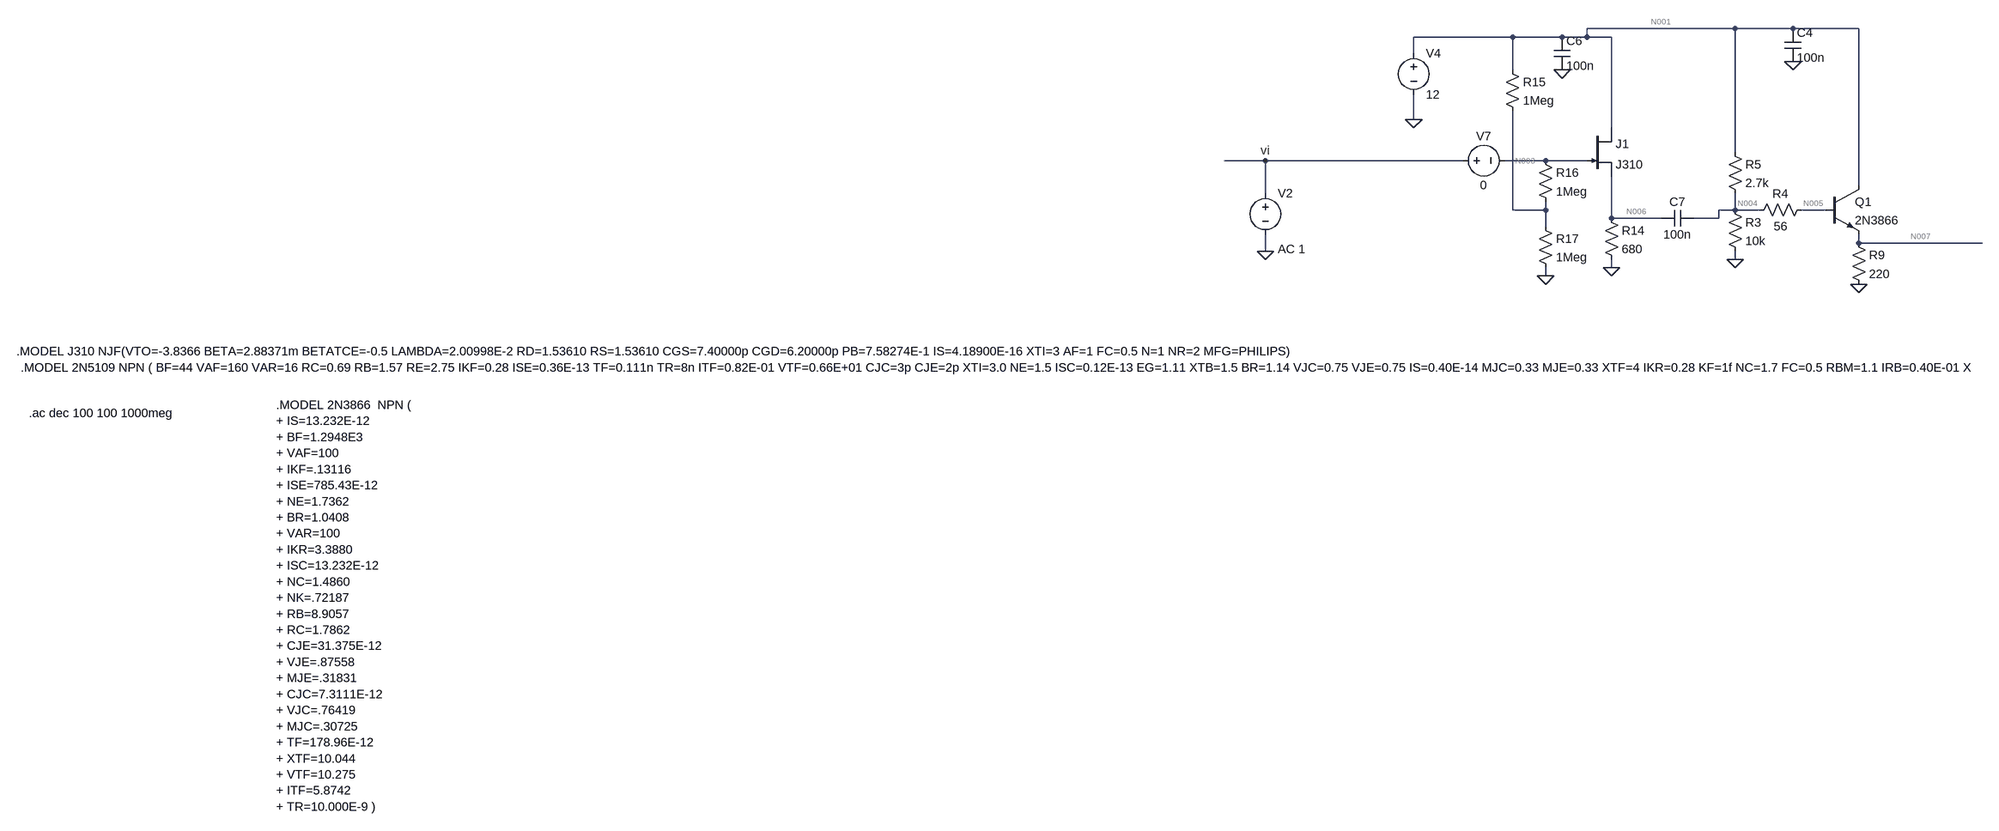
[diagram p0: schematic amplificador.asc]
amplificador.asc, the LTspice schematic file:
Version 4
SHEET 1 4184 1340
WIRE 3184 -128 2896 -128
WIRE 3296 -128 3184 -128
WIRE 3424 -128 3296 -128
WIRE 2752 -112 2560 -112
WIRE 2848 -112 2752 -112
WIRE 2896 -112 2896 -128
WIRE 2896 -112 2848 -112
WIRE 2944 -112 2896 -112
WIRE 2560 -80 2560 -112
WIRE 2752 -48 2752 -112
WIRE 2560 48 2560 0
WIRE 2944 64 2944 -112
WIRE 3184 112 3184 -128
WIRE 2272 128 2192 128
WIRE 2656 128 2272 128
WIRE 2816 128 2736 128
WIRE 2896 128 2816 128
WIRE 3424 176 3424 -128
WIRE 2272 192 2272 128
WIRE 2752 224 2752 32
WIRE 2816 224 2816 208
WIRE 2816 224 2752 224
WIRE 3184 224 3184 192
WIRE 3184 224 3152 224
WIRE 3232 224 3184 224
WIRE 3360 224 3312 224
WIRE 2944 240 2944 160
WIRE 3040 240 2944 240
WIRE 3152 240 3152 224
WIRE 3152 240 3104 240
WIRE 2816 256 2816 224
WIRE 3424 288 3424 272
WIRE 3664 288 3424 288
WIRE 2272 304 2272 272
WIRE 3184 320 3184 304
WIRE 2944 336 2944 320
WIRE 2816 352 2816 336
FLAG 2272 304 0
FLAG 3184 320 0
FLAG 2272 128 vi
FLAG 3296 -64 0
FLAG 3424 368 0
FLAG 2560 48 0
FLAG 2944 336 0
FLAG 2816 352 0
FLAG 2848 -48 0
SYMBOL res 3328 208 R90
WINDOW 0 0 56 VBottom 2
WINDOW 3 32 56 VTop 2
SYMATTR InstName R4
SYMATTR Value 56
SYMBOL voltage 2272 176 R0
WINDOW 3 24 152 Left 2
WINDOW 123 24 124 Left 2
WINDOW 39 0 0 Left 0
SYMATTR Value ""
SYMATTR Value2 AC 1
SYMATTR InstName V2
SYMBOL res 3168 208 R0
SYMATTR InstName R3
SYMATTR Value 10k
SYMBOL res 3168 96 R0
SYMATTR InstName R5
SYMATTR Value 2.7k
SYMBOL npn 3360 176 R0
SYMATTR InstName Q1
SYMATTR Value 2N3866
SYMBOL res 3408 272 R0
SYMATTR InstName R9
SYMATTR Value 220
SYMBOL cap 3280 -128 R0
SYMATTR InstName C4
SYMATTR Value 100n
SYMBOL njf 2896 64 R0
SYMATTR InstName J1
SYMATTR Value J310
SYMBOL voltage 2560 -96 R0
WINDOW 123 0 0 Left 0
WINDOW 39 0 0 Left 0
SYMATTR InstName V4
SYMATTR Value 12
SYMBOL res 2928 224 R0
SYMATTR InstName R14
SYMATTR Value 680
SYMBOL res 2736 -64 R0
SYMATTR InstName R15
SYMATTR Value 1Meg
SYMBOL res 2800 112 R0
SYMATTR InstName R16
SYMATTR Value 1Meg
SYMBOL res 2800 240 R0
SYMATTR InstName R17
SYMATTR Value 1Meg
SYMBOL cap 2832 -112 R0
SYMATTR InstName C6
SYMATTR Value 100n
SYMBOL voltage 2640 128 R270
WINDOW 0 32 56 VTop 2
WINDOW 3 -32 56 VBottom 2
WINDOW 123 0 0 Left 0
WINDOW 39 0 0 Left 0
SYMATTR InstName V7
SYMATTR Value 0
SYMBOL cap 3104 224 R90
WINDOW 0 0 32 VBottom 2
WINDOW 3 32 32 VTop 2
SYMATTR InstName C7
SYMATTR Value 100n
TEXT -152 520 Left 2 !.MODEL J310 NJF(VTO=-3.8366 BETA=2.88371m BETATCE=-0.5 LAMBDA=2.00998E-2 RD=1.53610 RS=1.53610 CGS=7.40000p CGD=6.20000p PB=7.58274E-1 IS=4.18900E-16 XTI=3 AF=1 FC=0.5 N=1 NR=2 MFG=PHILIPS)
TEXT -144 552 Left 2 !.MODEL 2N5109 NPN ( BF=44 VAF=160 VAR=16 RC=0.69 RB=1.57 RE=2.75 IKF=0.28 ISE=0.36E-13 TF=0.111n TR=8n ITF=0.82E-01 VTF=0.66E+01 CJC=3p CJE=2p XTI=3.0 NE=1.5 ISC=0.12E-13 EG=1.11 XTB=1.5 BR=1.14 VJC=0.75 VJE=0.75 IS=0.40E-14 MJC=0.33 MJE=0.33 XTF=4 IKR=0.28 KF=1f NC=1.7 FC=0.5 RBM=1.1 IRB=0.40E-01 XCJC=0.5 mfg=Motorola )
TEXT -128 640 Left 2 !.ac dec 100 100 1000meg
TEXT 352 624 Left 2 !.MODEL 2N3866  NPN (\n+ IS=13.232E-12\n+ BF=1.2948E3\n+ VAF=100\n+ IKF=.13116\n+ ISE=785.43E-12\n+ NE=1.7362\n+ BR=1.0408\n+ VAR=100\n+ IKR=3.3880\n+ ISC=13.232E-12\n+ NC=1.4860\n+ NK=.72187\n+ RB=8.9057\n+ RC=1.7862\n+ CJE=31.375E-12\n+ VJE=.87558\n+ MJE=.31831\n+ CJC=7.3111E-12\n+ VJC=.76419\n+ MJC=.30725\n+ TF=178.96E-12\n+ XTF=10.044\n+ VTF=10.275\n+ ITF=5.8742\n+ TR=10.000E-9 )

The netlist it stands for:
* amplificador.asc
R4 N005 N004 56
V2 vi 0 AC 1
R3 N004 0 10k
R5 N001 N004 2.7k
Q1 N001 N005 N007 0 2N3866
R9 N007 0 220
C4 N001 0 100n
J1 N001 N002 N006 J310
V4 N001 0 12
R14 N006 0 680
R15 N001 N003 1Meg
R16 N002 N003 1Meg
R17 N003 0 1Meg
C6 N001 0 100n
V7 vi N002 0
C7 N004 N006 100n
.model NPN NPN
.model PNP PNP
.lib standard.bjt
.model NJF NJF
.model PJF PJF
.lib standard.jft
.MODEL J310 NJF(VTO=-3.8366 BETA=2.88371m BETATCE=-0.5 LAMBDA=2.00998E-2 RD=1.53610 RS=1.53610 CGS=7.40000p CGD=6.20000p PB=7.58274E-1 IS=4.18900E-16 XTI=3 AF=1 FC=0.5 N=1 NR=2 MFG=PHILIPS)
.MODEL 2N5109 NPN ( BF=44 VAF=160 VAR=16 RC=0.69 RB=1.57 RE=2.75 IKF=0.28 ISE=0.36E-13 TF=0.111n TR=8n ITF=0.82E-01 VTF=0.66E+01 CJC=3p CJE=2p XTI=3.0 NE=1.5 ISC=0.12E-13 EG=1.11 XTB=1.5 BR=1.14 VJC=0.75 VJE=0.75 IS=0.40E-14 MJC=0.33 MJE=0.33 XTF=4 IKR=0.28 KF=1f NC=1.7 FC=0.5 RBM=1.1 IRB=0.40E-01 XCJC=0.5 mfg=Motorola )
.ac dec 100 100 1000meg
.MODEL 2N3866  NPN (
+ IS=13.232E-12
+ BF=1.2948E3
+ VAF=100
+ IKF=.13116
+ ISE=785.43E-12
+ NE=1.7362
+ BR=1.0408
+ VAR=100
+ IKR=3.3880
+ ISC=13.232E-12
+ NC=1.4860
+ NK=.72187
+ RB=8.9057
+ RC=1.7862
+ CJE=31.375E-12
+ VJE=.87558
+ MJE=.31831
+ CJC=7.3111E-12
+ VJC=.76419
+ MJC=.30725
+ TF=178.96E-12
+ XTF=10.044
+ VTF=10.275
+ ITF=5.8742
+ TR=10.000E-9 )
.backanno
.end

* Results of the author's LTspice run, read from the files saved beside the schematic
* Operating Point, zero values left out:
*   V(n005) = 8.766 V
*   V(n004) = 8.784 V
*   V(n001) = 12 V
*   V(n007) = 8.191 V
*   V(n006) = 2.744 V
*   V(n003) = 4 V
*   Ic(Q1) = 36.92 mA
*   Ib(Q1) = 312.9 µA
*   Ie(Q1) = -37.23 mA
*   Id(J1) = 4.035 mA
*   Ig(J1) = -14.74 pA
*   Is(J1) = -4.035 mA
*   I(R4) = -312.9 µA
*   I(R3) = 878.4 µA
*   I(R5) = 1.191 mA
*   I(R9) = 37.23 mA
*   I(R14) = 4.035 mA
*   I(R15) = 8 µA
*   I(R16) = -4 µA
*   I(R17) = 4 µA
*   I(V2) = 4 µA
*   I(V4) = -42.15 mA
*   I(V7) = -4 µA
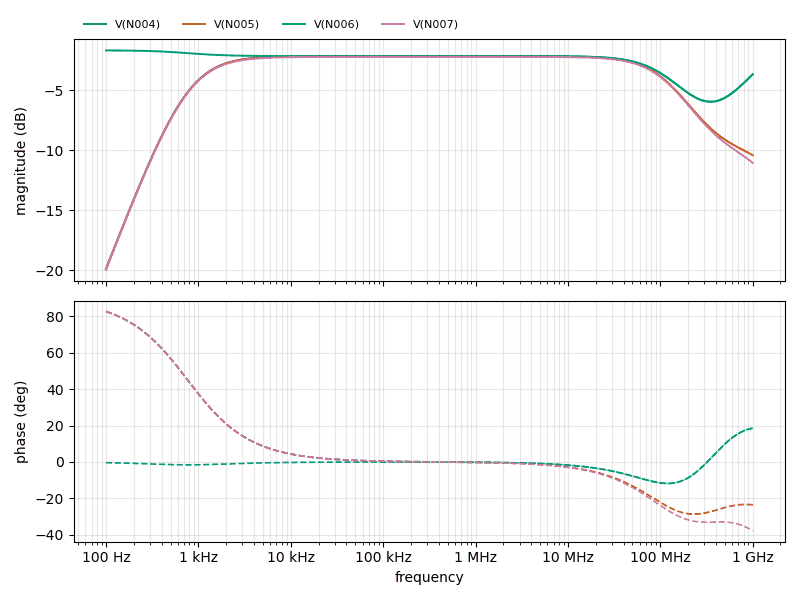
[diagram p1: AC Analysis of amplificador.asc, plotted from the saved traces]
* AC Analysis, 1 run:
*   V(N004): -19.87 dB at 100 Hz, -3.65 dB at 1 GHz, peak -2.13 dB at 338.8 kHz, 3 dB below the peak at 764.1 Hz and 194.3 MHz
*   V(N005): -19.89 dB at 100 Hz, -10.40 dB at 1 GHz, peak -2.15 dB at 331.1 kHz, 3 dB below the peak at 764.1 Hz and 154.5 MHz
*   V(N006): -1.66 dB at 100 Hz, -3.65 dB at 1 GHz, peak -1.66 dB at 100 Hz, 3 dB below the peak at 160.3 MHz
*   V(N007): -19.93 dB at 100 Hz, -11.03 dB at 1 GHz, peak -2.20 dB at 323.6 kHz, 3 dB below the peak at 764.1 Hz and 153.4 MHz